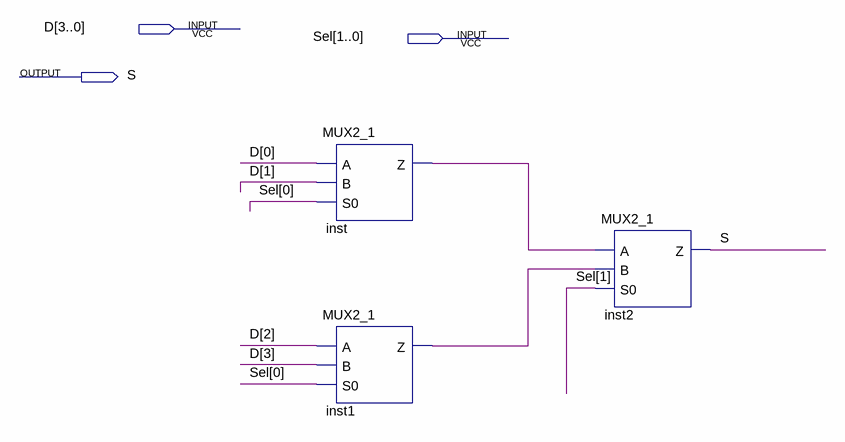
[diagram p0: schematic sheet]
// Quartus schematic mux41.bdf as structural Verilog: 3 symbols, 3 pins
module mux41 (
  input  [3:0] D,
  input  [1:0] Sel,
  output S
);

  wire inst1_z, inst_z;

  MUX2_1 inst (.A(D[0]), .B(D[1]), .S0(Sel[0]), .Z(inst_z));
  MUX2_1 inst1 (.A(D[2]), .B(D[3]), .S0(Sel[0]), .Z(inst1_z));
  MUX2_1 inst2 (.A(inst_z), .B(inst1_z), .S0(Sel[1]), .Z(S));
endmodule
